# EAGLE design breakout (EAGLE 7.5.0)
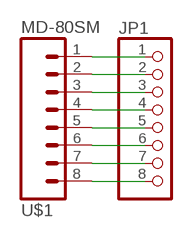
[diagram p0: schematic, sheet 1]

## Parts
JP1  PINHD-1X8  [1X08]
U$1  MD-80SM  [MD-80SM]

## Nets
N$1: JP1.8 U$1.8
N$2: JP1.3 U$1.3
N$3: JP1.1 U$1.1
N$4: JP1.2 U$1.2
N$5: JP1.4 U$1.4
N$6: JP1.5 U$1.5
N$7: JP1.6 U$1.6
N$8: JP1.7 U$1.7

## Library data of the parts
JP1 = pinhead:PINHD-1X8: PIN HEADER
U$1 = con-cui:MD-80SM

## Board
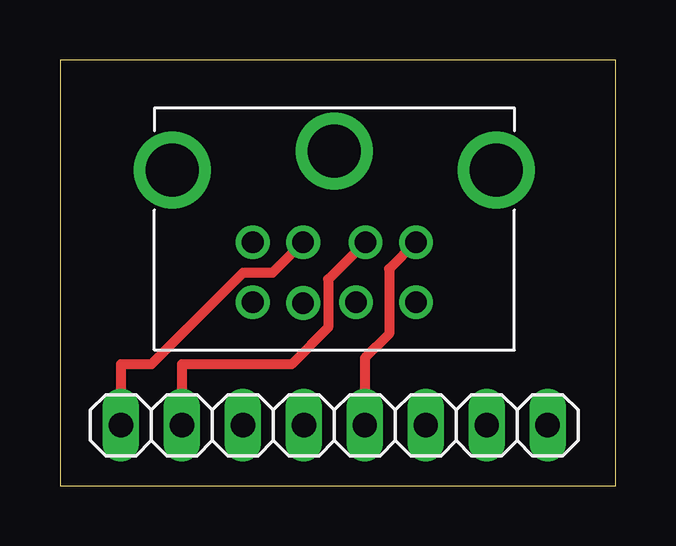
[diagram p1: board, top side]
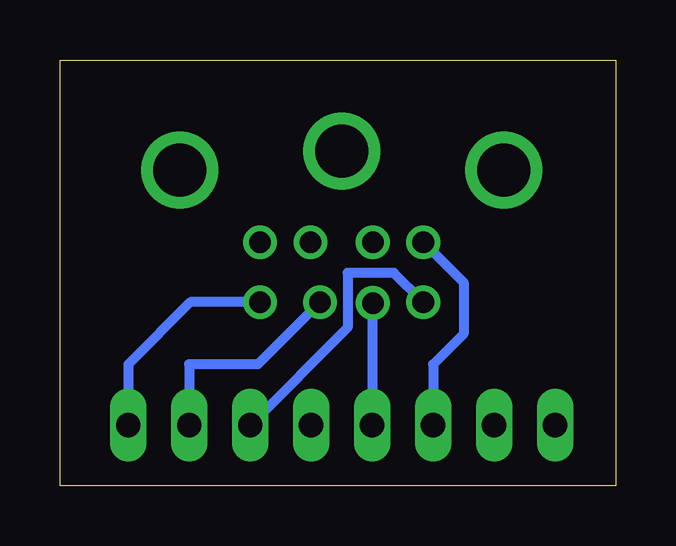
[diagram p2: board, bottom side, seen from below]

Size 23.16 x 17.77 mm. Coordinates in mm from the lower left corner, seen from the top.
Outline: 0,0 23.16,0 23.16,17.77 0,17.77 0,0
Copper layers (1*16): Top 0.035mm / dielectric 1.5mm / Bottom 0.035mm
Design rules "default": minimum track width 10mil, minimum drill 24mil, track to track 8mil, track to pad 8mil, pad to pad 8mil, via to via 8mil, smd to smd 8mil, copper to edge 40mil, drill to drill 8mil, minimum pad ring 10mil, minimum via ring 8mil, stop-mask expansion 4mil, vias tented up to drill 0mil, thermal gap 10mil

### Footprints (pad centres in the part's own frame; a part is rotated, then mirrored left to right if it is on the bottom)
1X08 = drill 1.016 long: 1 -8.89,0; 2 -6.35,0; 3 -3.81,0; 4 -1.27,0; 5 1.27,0; 6 3.81,0; 7 6.35,0; 8 8.89,0
MD-80SM = drill 0.9: 1 -1.3,-3.8; 2 1.3,-3.8; 3 -3.4,-3.8; 4 -1.3,-6.34; 5 3.4,-3.8; 6 -3.4,-6.3; 7 0.9,-6.3; 8 3.4,-6.3 | drill 2.2: P$1 0,0; P$2 -6.75,-0.8; P$3 6.75,-0.8

### Placement (x,y rotation side)
JP1  11.43,2.54 0 top
U$1  11.43,13.97 0 top

### Tracks (layer width: path | path; a pad name or v marks a point on that pad's centre or on a via)
N$1
  Bottom 0.406: U$1.8 17.73,7.67 20.32,5.08 JP1.8
N$2
  Bottom 0.406: U$1.3 6.35,8.49 6.35,6.35 7.62,5.08 JP1.3
N$3
  Top 0.406: U$1.1 8.85,8.89 7.62,8.89 3.81,5.08 2.54,5.08 JP1.1
N$4
  Top 0.406: U$1.2 11.18,8.62 11.18,6.6 9.65,5.08 5.08,5.08 JP1.2
N$5
  Bottom 0.406: JP1.4 10.13,2.57 U$1.4
N$6
  Top 0.406: U$1.5 13.72,9.06 13.72,6.35 12.7,5.33 JP1.5
N$7
  Bottom 0.406: U$1.6 9.25,8.89 11.18,8.89 11.18,6.6 JP1.6
N$8
  Bottom 0.406: U$1.7 14.92,5.08 17.78,5.08 JP1.7